# Altium schematic sheet sche_DPN_ControlVan.SchDoc
size A3
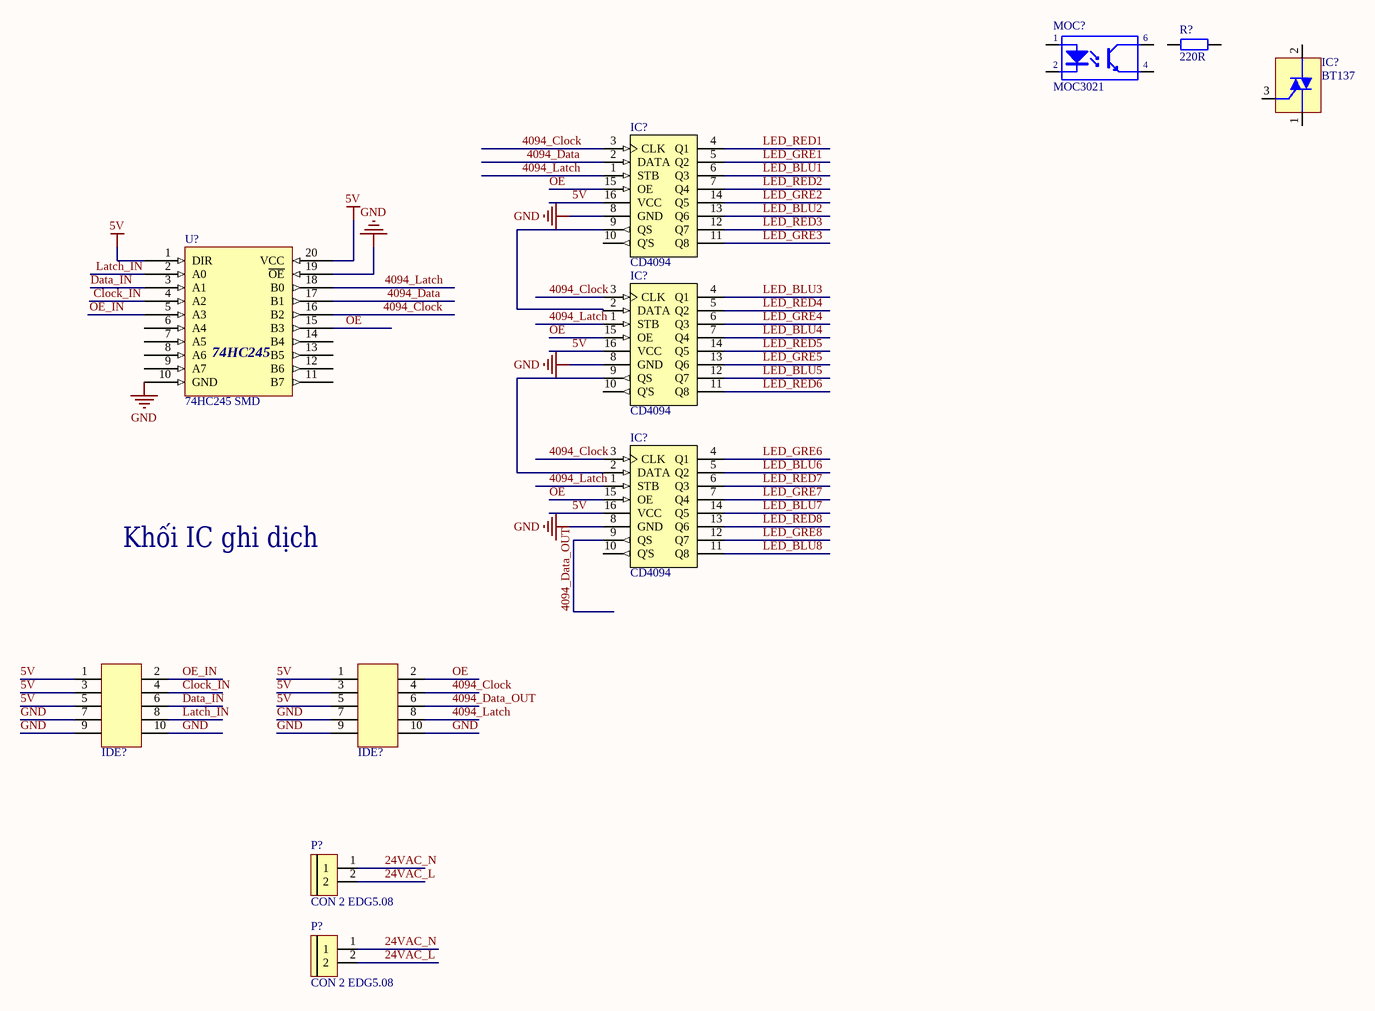
[diagram p0: sche_DPN_ControlVan.SchDoc]

## Parts
(Parts that share a designator on the sheet are numbered #1, #2 ... from top to bottom, then left to right.)
IC?#1  BT137  [TO252]
IC?#2  CD4094  [CD4094]
IC?#3  CD4094  [CD4094]
IC?#4  CD4094  [CD4094]
IDE?#1  IDE10  [IDE10_Cong]  (value not drawn)
IDE?#2  IDE10  [IDE10_Cong]  (value not drawn)
MOC?  MOC3021  [DIP6]
P?#1  CON 2 EDG5.08  [CON 2 2EDG5.08]
P?#2  CON 2 EDG5.08  [CON 2 2EDG5.08]
R?  220R  [tro smd 0805]
U?  74HC245 SMD  [SOP 20]

## Nets
5V: IC?#2.16(VCC) IC?#3.16(VCC) IC?#4.16(VCC) IDE?#1.1 IDE?#1.3 IDE?#1.5 IDE?#2.1 IDE?#2.3 IDE?#2.5 U?.1(DIR) U?.20(VCC)
GND: IC?#2.8(GND) IC?#3.8(GND) IC?#4.8(GND) IDE?#1.7 IDE?#1.9 IDE?#1.10 IDE?#2.7 IDE?#2.9 IDE?#2.10 U?.10(GND) U?.19(~{OE})
24VAC_L: P?#1.2 P?#2.2
24VAC_N: P?#1.1 P?#2.1
4094_Clock: IC?#2.3(CLK) IC?#3.3(CLK) IC?#4.3(CLK) IDE?#2.4 U?.16(B2)
4094_Data: IC?#2.2(DATA) U?.17(B1)
4094_Data_OUT: IC?#4.9(QS) IDE?#2.6
4094_Latch: IC?#2.1(STB) IC?#3.1(STB) IC?#4.1(STB) IDE?#2.8 U?.18(B0)
Clock_IN: IDE?#1.4 U?.4(A2)
Data_IN: IDE?#1.6 U?.3(A1)
Latch_IN: IDE?#1.8 U?.2(A0)
LED_BLU1: IC?#2.6(Q3)
LED_BLU2: IC?#2.13(Q6)
LED_BLU3: IC?#3.4(Q1)
LED_BLU4: IC?#3.7(Q4)
LED_BLU5: IC?#3.12(Q7)
LED_BLU6: IC?#4.5(Q2)
LED_BLU7: IC?#4.14(Q5)
LED_BLU8: IC?#4.11(Q8)
LED_GRE1: IC?#2.5(Q2)
LED_GRE2: IC?#2.14(Q5)
LED_GRE3: IC?#2.11(Q8)
LED_GRE4: IC?#3.6(Q3)
LED_GRE5: IC?#3.13(Q6)
LED_GRE6: IC?#4.4(Q1)
LED_GRE7: IC?#4.7(Q4)
LED_GRE8: IC?#4.12(Q7)
LED_RED1: IC?#2.4(Q1)
LED_RED2: IC?#2.7(Q4)
LED_RED3: IC?#2.12(Q7)
LED_RED4: IC?#3.5(Q2)
LED_RED5: IC?#3.14(Q5)
LED_RED6: IC?#3.11(Q8)
LED_RED7: IC?#4.6(Q3)
LED_RED8: IC?#4.13(Q6)
OE: IC?#2.15(OE) IC?#3.15(OE) IC?#4.15(OE) IDE?#2.2 U?.15(B3)
OE_IN: IDE?#1.2 U?.5(A3)
NetIC?#2_9: IC?#2.9(QS) IC?#3.2(DATA)
NetIC?#3_9: IC?#3.9(QS) IC?#4.2(DATA)

Not connected (* = marked no-connect by the designer): IC?#1 1 2 3; IC?#2 10(Q'S); IC?#3 10(Q'S); IC?#4 10(Q'S); MOC? 1(A) 2(K) 4(E) 6(C); R? 1 2; U? 6(A4) 7(A5) 8(A6) 9(A7) 11(B7) 12(B6) 13(B5) 14(B4)

## Notes on the sheet
- Khối IC ghi dịch
- (in symbol 74HC245 SMD) 74HC245

## Library data of the parts
IC?#2-IC?#4 = CD4094 SMD: Dán; Ten_Linh_Kien: CD4094 SOP16; Don_Vi: Con; Ma_Hang: MH002295; Ghi_Chu: *; Kieu_Chan: *; Chung_Loai: Dán
IDE?#1 IDE?#2 = IDE 10 DT
P?#1 P?#2 = CON 2 EDG5.08: Cắm; Ten_Linh_Kien: CON 2 2EDG5.08-2P 5.08MM ( Xanh Cong); Ma_Hang: MH000759; Ghi_Chu: *; Don_Vi: Con; Kieu_Chan: *; Chung_Loai: Cắm
R? = Tro 0805 5% 220R: Dán; Don_Vi: Con; So_Chan: 2; Ten_Linh_Kien: Trở 0805 5% 220R; Ma_Hang: MH005259; Chung_Loai: Dán; Kieu_Chan: *
U? = 74HC245 SMD: Dán; Ten_Linh_Kien: 74HC245DW SSOP20 5.2MM; Don_Vi: Con; Ma_Hang: MH003571; Ghi_Chu: *; Kieu_Chan: *; Chung_Loai: Dán